# Altium schematic sheet 4ChannelADCs.SchDoc
size A4; SheetNumber: 4; SheetTotal: 5
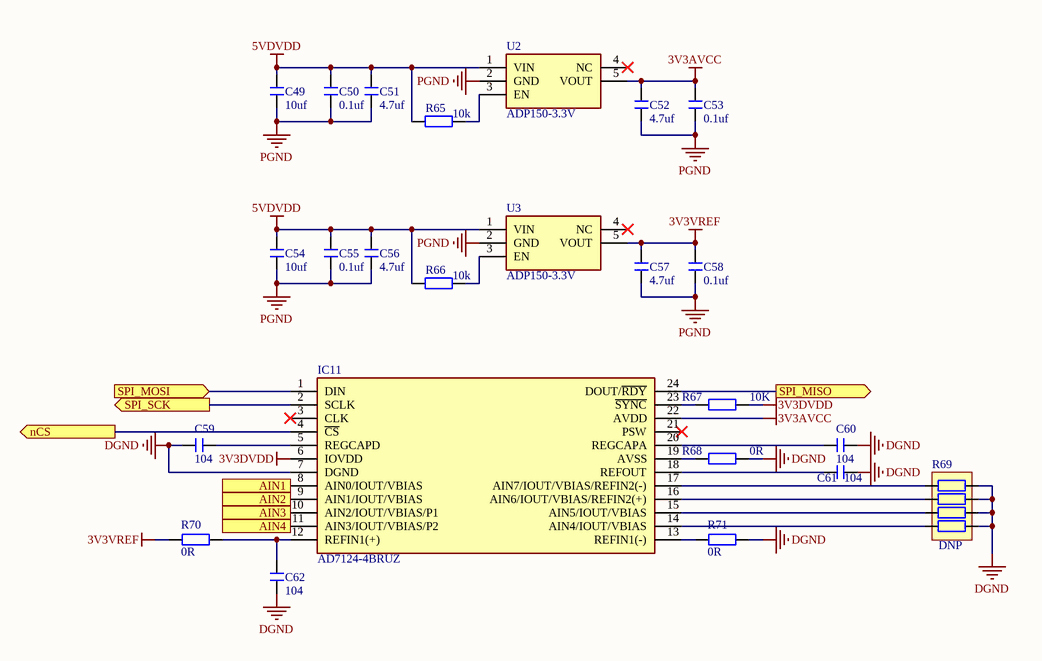
[diagram p0: 4ChannelADCs.SchDoc]

## Parts
C49  10uf  [C 0805_L]
C50  0.1uf  [C 0805_L]
C51  4.7uf  [C 0805_L]
C52  4.7uf  [C 0805_L]
C53  0.1uf  [C 0805_L]
C54  10uf  [C 0805_L]
C55  0.1uf  [C 0805_L]
C56  4.7uf  [C 0805_L]
C57  4.7uf  [C 0805_L]
C58  0.1uf  [C 0805_L]
C59  104  [C 0603_L]
C60  104  [C 0603_L]
C61  104  [C 0603_L]
C62  104  [C 0603_L]
IC11  AD7124-4BRUZ  [SOP65P640X120-24N]
R65  10k  [0805_R]
R66  10k  [0805_R]
R67  10K  [R 0603_L]
R68  0R  [R 0603_L]
R69  DNP  [RCA-8P4R-0603]
R70  0R  [R 0603_L]
R71  0R  [R 0603_L]
U2  ADP150-3.3V
U3  ADP150-3.3V

## Ports
AIN1 (in), AIN2 (in), AIN3 (in), AIN4 (in), nCS (out), SPI_MISO (out), SPI_MOSI (in), SPI_SCK (out)

## Nets
3V3AVCC: C52.2 C53.2 IC11.22(AVDD) U2.5(VOUT)
3V3DVDD: IC11.6(IOVDD) R67.1
3V3VREF: C57.2 C58.2 R70.2 U3.5(VOUT)
5VDVDD: C49.2 C50.2 C51.2 C54.2 C55.2 C56.2 R65.1 R66.1 U2.1(VIN) U3.1(VIN)
DGND: C59.1 C60.1 C61.1 C62.1 IC11.7(DGND) R68.1 R69.5 R69.6 R69.7 R69.8 R71.1
PGND: C49.1 C50.1 C51.1 C52.1 C53.1 C54.1 C55.1 C56.1 C57.1 C58.1 U2.2(GND) U3.2(GND)
AIN1: IC11.8(AIN0/IOUT/VBIAS) ; port AIN1
AIN2: IC11.9(AIN1/IOUT/VBIAS) ; port AIN2
AIN3: IC11.10(AIN2/IOUT/VBIAS/P1) ; port AIN3
AIN4: IC11.11(AIN3/IOUT/VBIAS/P2) ; port AIN4
nCS: IC11.4(~{CS}) ; port nCS
SPI_MISO: IC11.24(DOUT/~{RDY}) ; port SPI_MISO
SPI_MOSI: IC11.1(DIN) ; port SPI_MOSI
SPI_SCK: IC11.2(SCLK) ; port SPI_SCK
NetC59_2: C59.2 IC11.5(REGCAPD)
NetC60_2: C60.2 IC11.20(REGCAPA)
NetC61_2: C61.2 IC11.18(REFOUT)
NetC62_2: C62.2 IC11.12(REFIN1(+)) R70.1
NetIC11_13: IC11.13(REFIN1(-)) R71.2
NetIC11_14: IC11.14(AIN4/IOUT/VBIAS) R69.4
NetIC11_15: IC11.15(AIN5/IOUT/VBIAS) R69.3
NetIC11_16: IC11.16(AIN6/IOUT/VBIAS/REFIN2(+)) R69.2
NetIC11_17: IC11.17(AIN7/IOUT/VBIAS/REFIN2(-)) R69.1
NetIC11_19: IC11.19(AVSS) R68.2
NetIC11_23: IC11.23(~{SYNC}) R67.2
NetR65_2: R65.2 U2.3(EN)
NetR66_2: R66.2 U3.3(EN)

Not connected (* = marked no-connect by the designer): IC11 3(CLK)* 21(PSW)*; U2 4(NC)*; U3 4(NC)*

## Library data of the parts
C49-C62 = C: 贴片电容; BOM名称: 无极性贴片电容
IC11 = AD7124-4BRUZ: Integrated Circuit; Manufacturer_Name: Analog Devices; Datasheet Link: http://www.analog.com/media/en/technical-documentation/data-sheets/AD7124-4.pdf; Height: 1.2mm; Manufacturer_Part_Number: AD7124-4BRUZ; Mouser Part Number: 584-AD7124-4BRUZ; Mouser Price/Stock: https://www.mouser.co.uk/ProductDetail/Analog-Devices/AD7124-4BRUZ?qs=8Sj0zgMuDMVqCrsELALuFg%3D%3D; Arrow Part Number: AD7124-4BRUZ; Arrow Price/Stock: https://www.arrow.com/en/products/ad7124-4bruz/analog-devices?region=nac
R65 R66 = 0805 电阻: 贴片电阻 0805 电阻; ComponentLink1Description: 供应商链接; ComponentLink1URL: http://www.szlcsc.com/product/details_18165.html; Package: 0805; Supplier: LC; SuppliersPartNumber: C17477
R67 R68 R70 R71 = R: 贴片电阻; BOM名称: 贴片电阻
R69 = R-8P4R: 贴片排阻; BOM名称: 贴片网络排阻
U2 U3 = ADP150: IOVDD needs 1.8V